# EAGLE design TSMP-GLV (EAGLE 9.4.0)
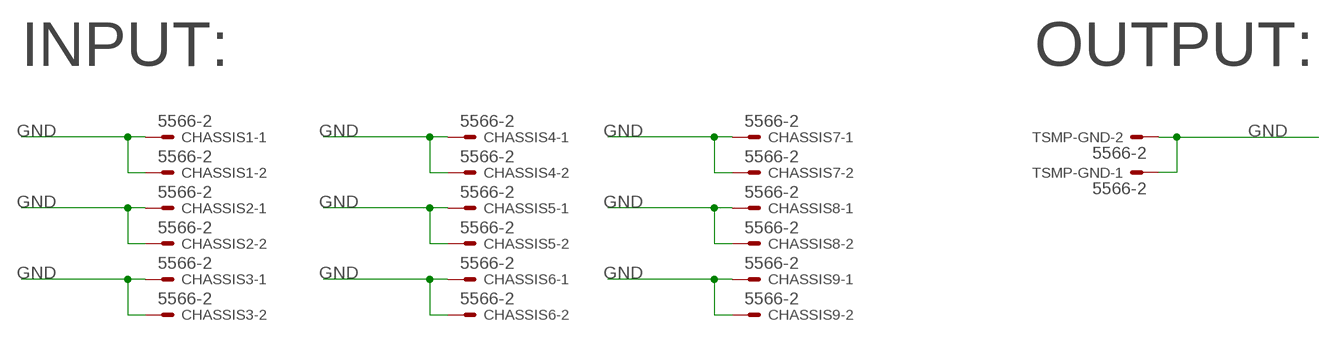
[diagram p0: schematic, sheet 1]

## Parts
CHASSIS1  5566-2  [5566-2]
CHASSIS2  5566-2  [5566-2]
CHASSIS3  5566-2  [5566-2]
CHASSIS4  5566-2  [5566-2]
CHASSIS5  5566-2  [5566-2]
CHASSIS6  5566-2  [5566-2]
CHASSIS7  5566-2  [5566-2]
CHASSIS8  5566-2  [5566-2]
CHASSIS9  5566-2  [5566-2]
TSMP-GND  5566-2  [5566-2]

## Nets
GND: CHASSIS1.1 CHASSIS1.2 CHASSIS2.1 CHASSIS2.2 CHASSIS3.1 CHASSIS3.2 CHASSIS4.1 CHASSIS4.2 CHASSIS5.1 CHASSIS5.2 CHASSIS6.1 CHASSIS6.2 CHASSIS7.1 CHASSIS7.2 CHASSIS8.1 CHASSIS8.2 CHASSIS9.1 CHASSIS9.2 TSMP-GND.1 TSMP-GND.2

## Notes on the sheet
- INPUT: | OUTPUT:

## Library data of the parts
CHASSIS1-CHASSIS9 TSMP-GND = con-molex:5566-2: Mini FIT connector 2 pol Source: http://www.molex.com; MF: MOLEX; OC_FARNELL: 1822072; OC_NEWARK: unknown

## Board
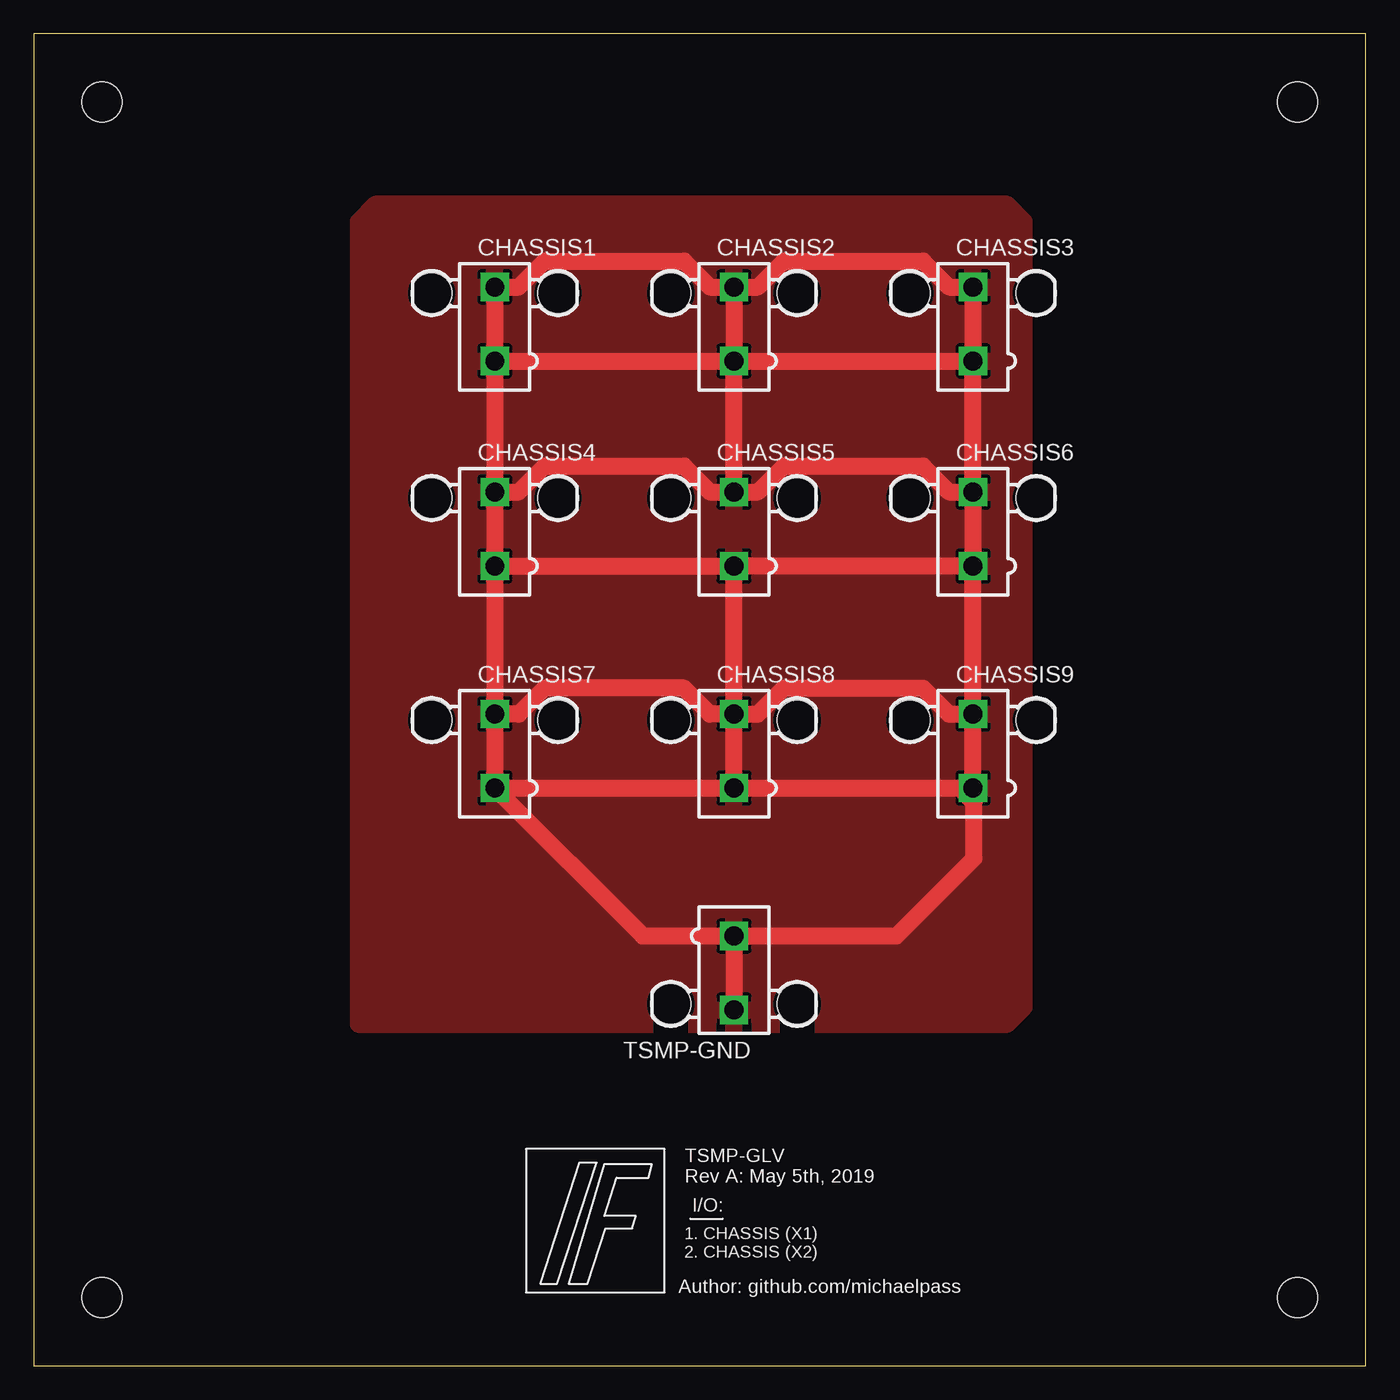
[diagram p1: board, top side]

Size 99.06 x 99.06 mm. Coordinates in mm from the lower left corner, seen from the top.
Outline: 0,0 99.06,0 99.06,99.06 0,99.06 0,0
Copper layers (1*16): Top 0.035mm / dielectric 1.5mm / Bottom 0.035mm
Design rules "default *": minimum track width 8mil, minimum drill 20mil, track to track 8mil, track to pad 8mil, pad to pad 8mil, via to via 8mil, smd to smd 8mil, copper to edge 10mil, drill to drill 8mil, minimum pad ring 12mil, minimum via ring 10mil, stop-mask expansion 4mil, vias tented up to drill 25mil, thermal gap 10mil
Holes 3 mm at 93.98,93.98 5.08,93.98 5.08,5.08 93.98,5.08

### Footprints (pad centres in the part's own frame; a part is rotated, then mirrored left to right if it is on the bottom)
5566-2 = drill 1.4 square: 1 0,-2.75; 2 0,2.75 | hole 3: 4.7,2.29; -4.7,2.29

### Placement (x,y rotation side)
CHASSIS1  34.29,77.47 0 top
CHASSIS2  52.07,77.47 0 top
CHASSIS3  69.85,77.47 0 top
CHASSIS4  34.29,62.23 0 top
CHASSIS5  52.07,62.23 0 top
CHASSIS6  69.85,62.23 0 top
CHASSIS7  34.29,45.72 0 top
CHASSIS8  52.07,45.72 0 top
CHASSIS9  69.85,45.72 0 top
TSMP-GND  52.07,29.21 180 top

### Tracks (layer width: path | path; a pad name or v marks a point on that pad's centre or on a via)
GND
  Top 1.27: CHASSIS1.1 CHASSIS1.2 36.07,80.22 38,82.15 48.36,82.15 50.29,80.22 CHASSIS2.2 | CHASSIS1.1 CHASSIS2.1 | CHASSIS2.1 CHASSIS3.1 | CHASSIS2.2 53.85,80.22 55.78,82.15 66.14,82.15 68.07,80.22 CHASSIS3.2 CHASSIS3.1 | CHASSIS2.2 CHASSIS2.1 | CHASSIS1.1 CHASSIS4.2 | CHASSIS4.2 CHASSIS4.1 | CHASSIS4.1 CHASSIS5.1 | CHASSIS4.2 36.07,64.98 38,66.91 48.36,66.91 50.29,64.98 CHASSIS5.2 | CHASSIS5.2 53.85,64.98 55.78,66.91 66.14,66.91 68.07,64.98 CHASSIS6.2 | CHASSIS6.2 CHASSIS3.1 | CHASSIS5.2 CHASSIS2.1 | CHASSIS6.2 CHASSIS6.1 | CHASSIS6.1 CHASSIS5.1 | CHASSIS4.1 CHASSIS7.2 | CHASSIS7.2 CHASSIS7.1 | CHASSIS7.1 45.3,31.96 TSMP-GND.1 | TSMP-GND.1 TSMP-GND.2 | TSMP-GND.1 64.14,31.96 69.93,37.74 69.93,41.91 | 69.93,41.91 69.93,42.89 CHASSIS9.1 CHASSIS9.2 | CHASSIS8.1 68.87,42.97 69.93,41.91 | CHASSIS8.1 CHASSIS8.2 | CHASSIS8.2 CHASSIS5.1 | CHASSIS9.2 CHASSIS6.1 | CHASSIS8.2 53.85,48.47 55.78,50.4 66.14,50.4 68.07,48.47 CHASSIS9.2 | CHASSIS8.2 50.29,48.47 48.36,50.4 38,50.4 36.07,48.47 CHASSIS7.2 | CHASSIS7.1 CHASSIS8.1
  pour Top: 24.13,85.09 24.13,25.4 72.39,25.4 73.66,26.67 73.66,85.09 72.39,86.36 25.4,86.36

### Text on the board
tNames: TSMP-GLV / Rev A: May 5th, 2019 | I/O: | 1. CHASSIS (X1) / 2. CHASSIS (X2) | Author: github.com/michaelpass